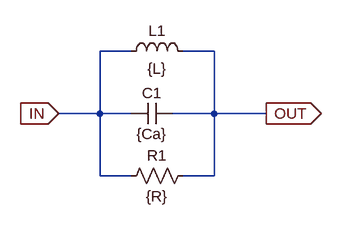
[diagram p0: schematic coil_highLoss.asc]
coil_highLoss.asc, the LTspice schematic file:
Version 4
SHEET 1 880 680
WIRE 160 80 112 80
WIRE 288 80 240 80
WIRE 112 176 112 80
WIRE 112 176 48 176
WIRE 160 176 112 176
WIRE 288 176 288 80
WIRE 288 176 224 176
WIRE 368 176 288 176
WIRE 112 272 112 176
WIRE 160 272 112 272
WIRE 288 272 288 176
WIRE 288 272 240 272
FLAG 48 176 IN
IOPIN 48 176 In
FLAG 368 176 OUT
IOPIN 368 176 Out
SYMBOL ind 144 96 R270
WINDOW 0 32 56 VTop 2
WINDOW 3 5 56 VBottom 2
SYMATTR InstName L1
SYMATTR Value {L}
SYMBOL cap 160 192 R270
WINDOW 0 32 32 VTop 2
WINDOW 3 0 32 VBottom 2
SYMATTR InstName C1
SYMATTR Value {Ca}
SYMBOL res 256 256 R90
WINDOW 0 0 56 VBottom 2
WINDOW 3 32 56 VTop 2
SYMATTR InstName R1
SYMATTR Value {R}

The netlist it stands for:
* coil_highLoss.asc
L1 IN OUT {L}
C1 IN OUT {Ca}
R1 OUT IN {R}
.backanno
.end